# EAGLE schematic ehomeLight_doit (EAGLE 8.7.0)
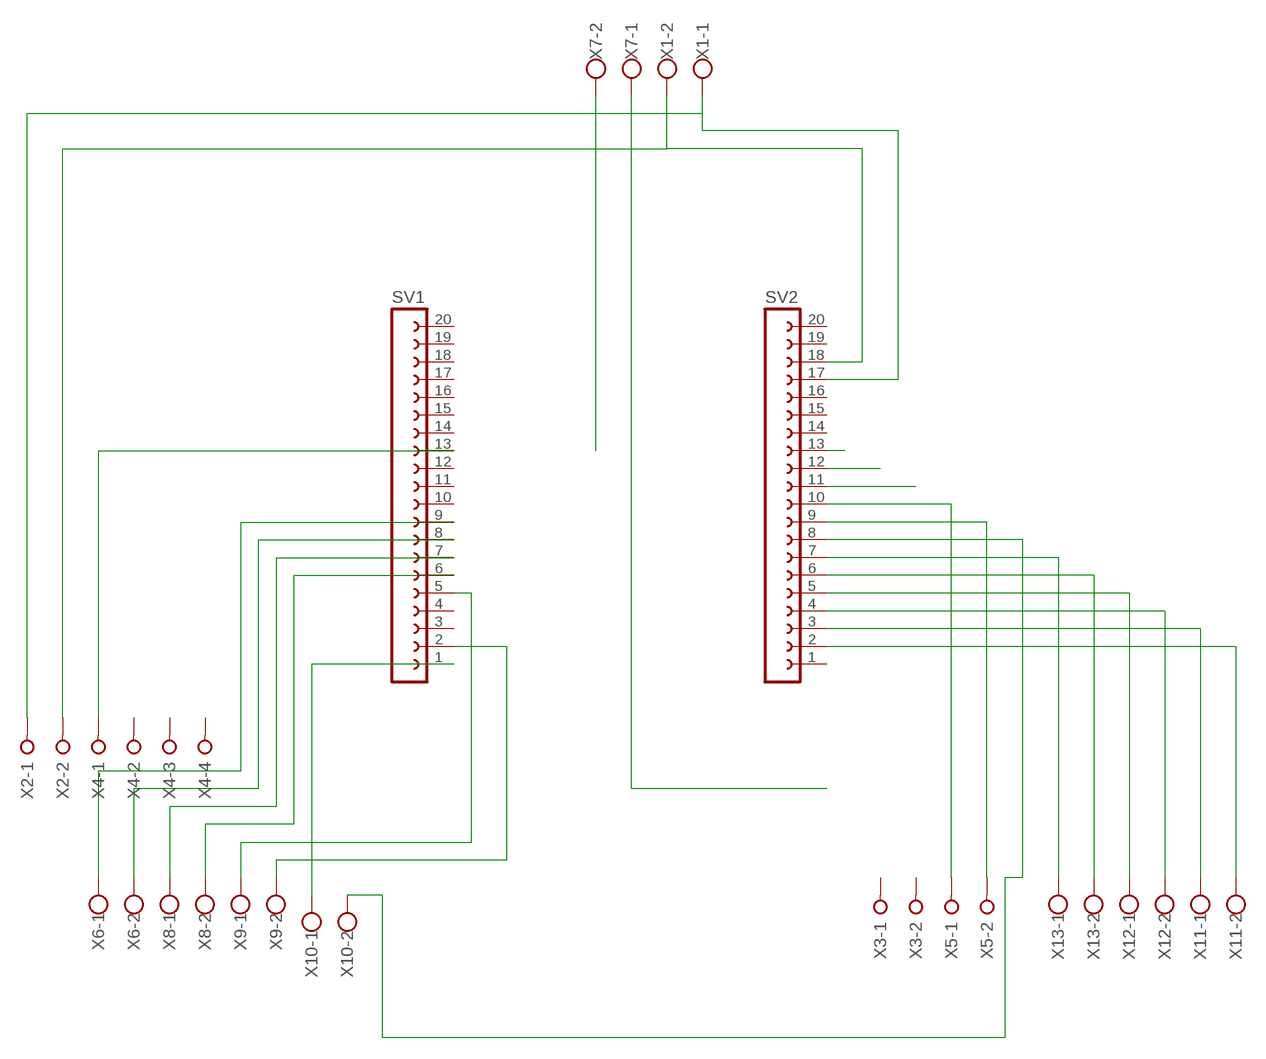
[diagram p0: schematic, sheet 1]

## Parts
SV1  FE20-1  [FE20]
SV2  FE20-1  [FE20]
X1  W237-102  [W237-102]
X2  W237-02P  [W237-132]
X3  W237-02P  [W237-132]
X4  W237-04P  [W237-4P]
X5  W237-02P  [W237-132]
X6  W237-102  [W237-102]
X7  W237-102  [W237-102]
X8  W237-102  [W237-102]
X9  W237-102  [W237-102]
X10  W237-102  [W237-102]
X11  W237-102  [W237-102]
X12  W237-102  [W237-102]
X13  W237-102  [W237-102]

## Nets
GND: SV2.17 X1.1 X2.1
GPIO5: SV1.8 X6.2
GPIO12: SV2.12
GPIO13: X7.2
GPIO14: SV2.11
GPIO15: SV1.13 X4.1
GPIO17: SV1.9 X6.1
GPIO18: SV1.7 X8.1
GPIO19: SV1.6 X8.2
GPIO21: SV1.5 X9.1
GPIO22: SV1.2 X9.2
GPIO23: SV1.1 X10.1
GPIO25: SV2.8 X10.2
GPIO26: SV2.9 X5.2
GPIO27: SV2.10 X5.1
GPIO32: SV2.6 X13.2
GPIO33: SV2.7 X13.1
GPIO34: SV2.4 X12.2
GPIO35: SV2.5 X12.1
GPIO36: SV2.2 X11.2
GPIO39: SV2.3 X11.1
N$1: X7.1
N$2: SV2.13
PWR: SV2.18 X1.2 X2.2
Unconnected: SV1.3 SV1.4 SV1.10 SV1.11 SV1.12 SV1.14 SV1.15 SV1.16 SV1.17 SV1.18 SV1.19 SV1.20 SV2.1 SV2.14 SV2.15 SV2.16 SV2.19 SV2.20 X3.1 X3.2 X4.2 X4.3 X4.4

## Library data of the parts
SV1 SV2 = con-lsta:FE20-1: FEMALE HEADER; OC_FARNELL: unknown; OC_NEWARK: unknown
X1 X6-X13 = con-wago-500:W237-102: WAGO SCREW CLAMP; MPN: 237-102; OC_FARNELL: unknown; OC_NEWARK: 70K9898
X2 X3 X5 = con-wago-508:W237-02P: WAGO SREW CLAMP; OC_FARNELL: unknown; OC_NEWARK: unknown
X4 = con-wago-508:W237-04P: WAGO SREW CLAMP; OC_FARNELL: unknown; OC_NEWARK: unknown